# EAGLE design untitled (EAGLE 7.2.0)
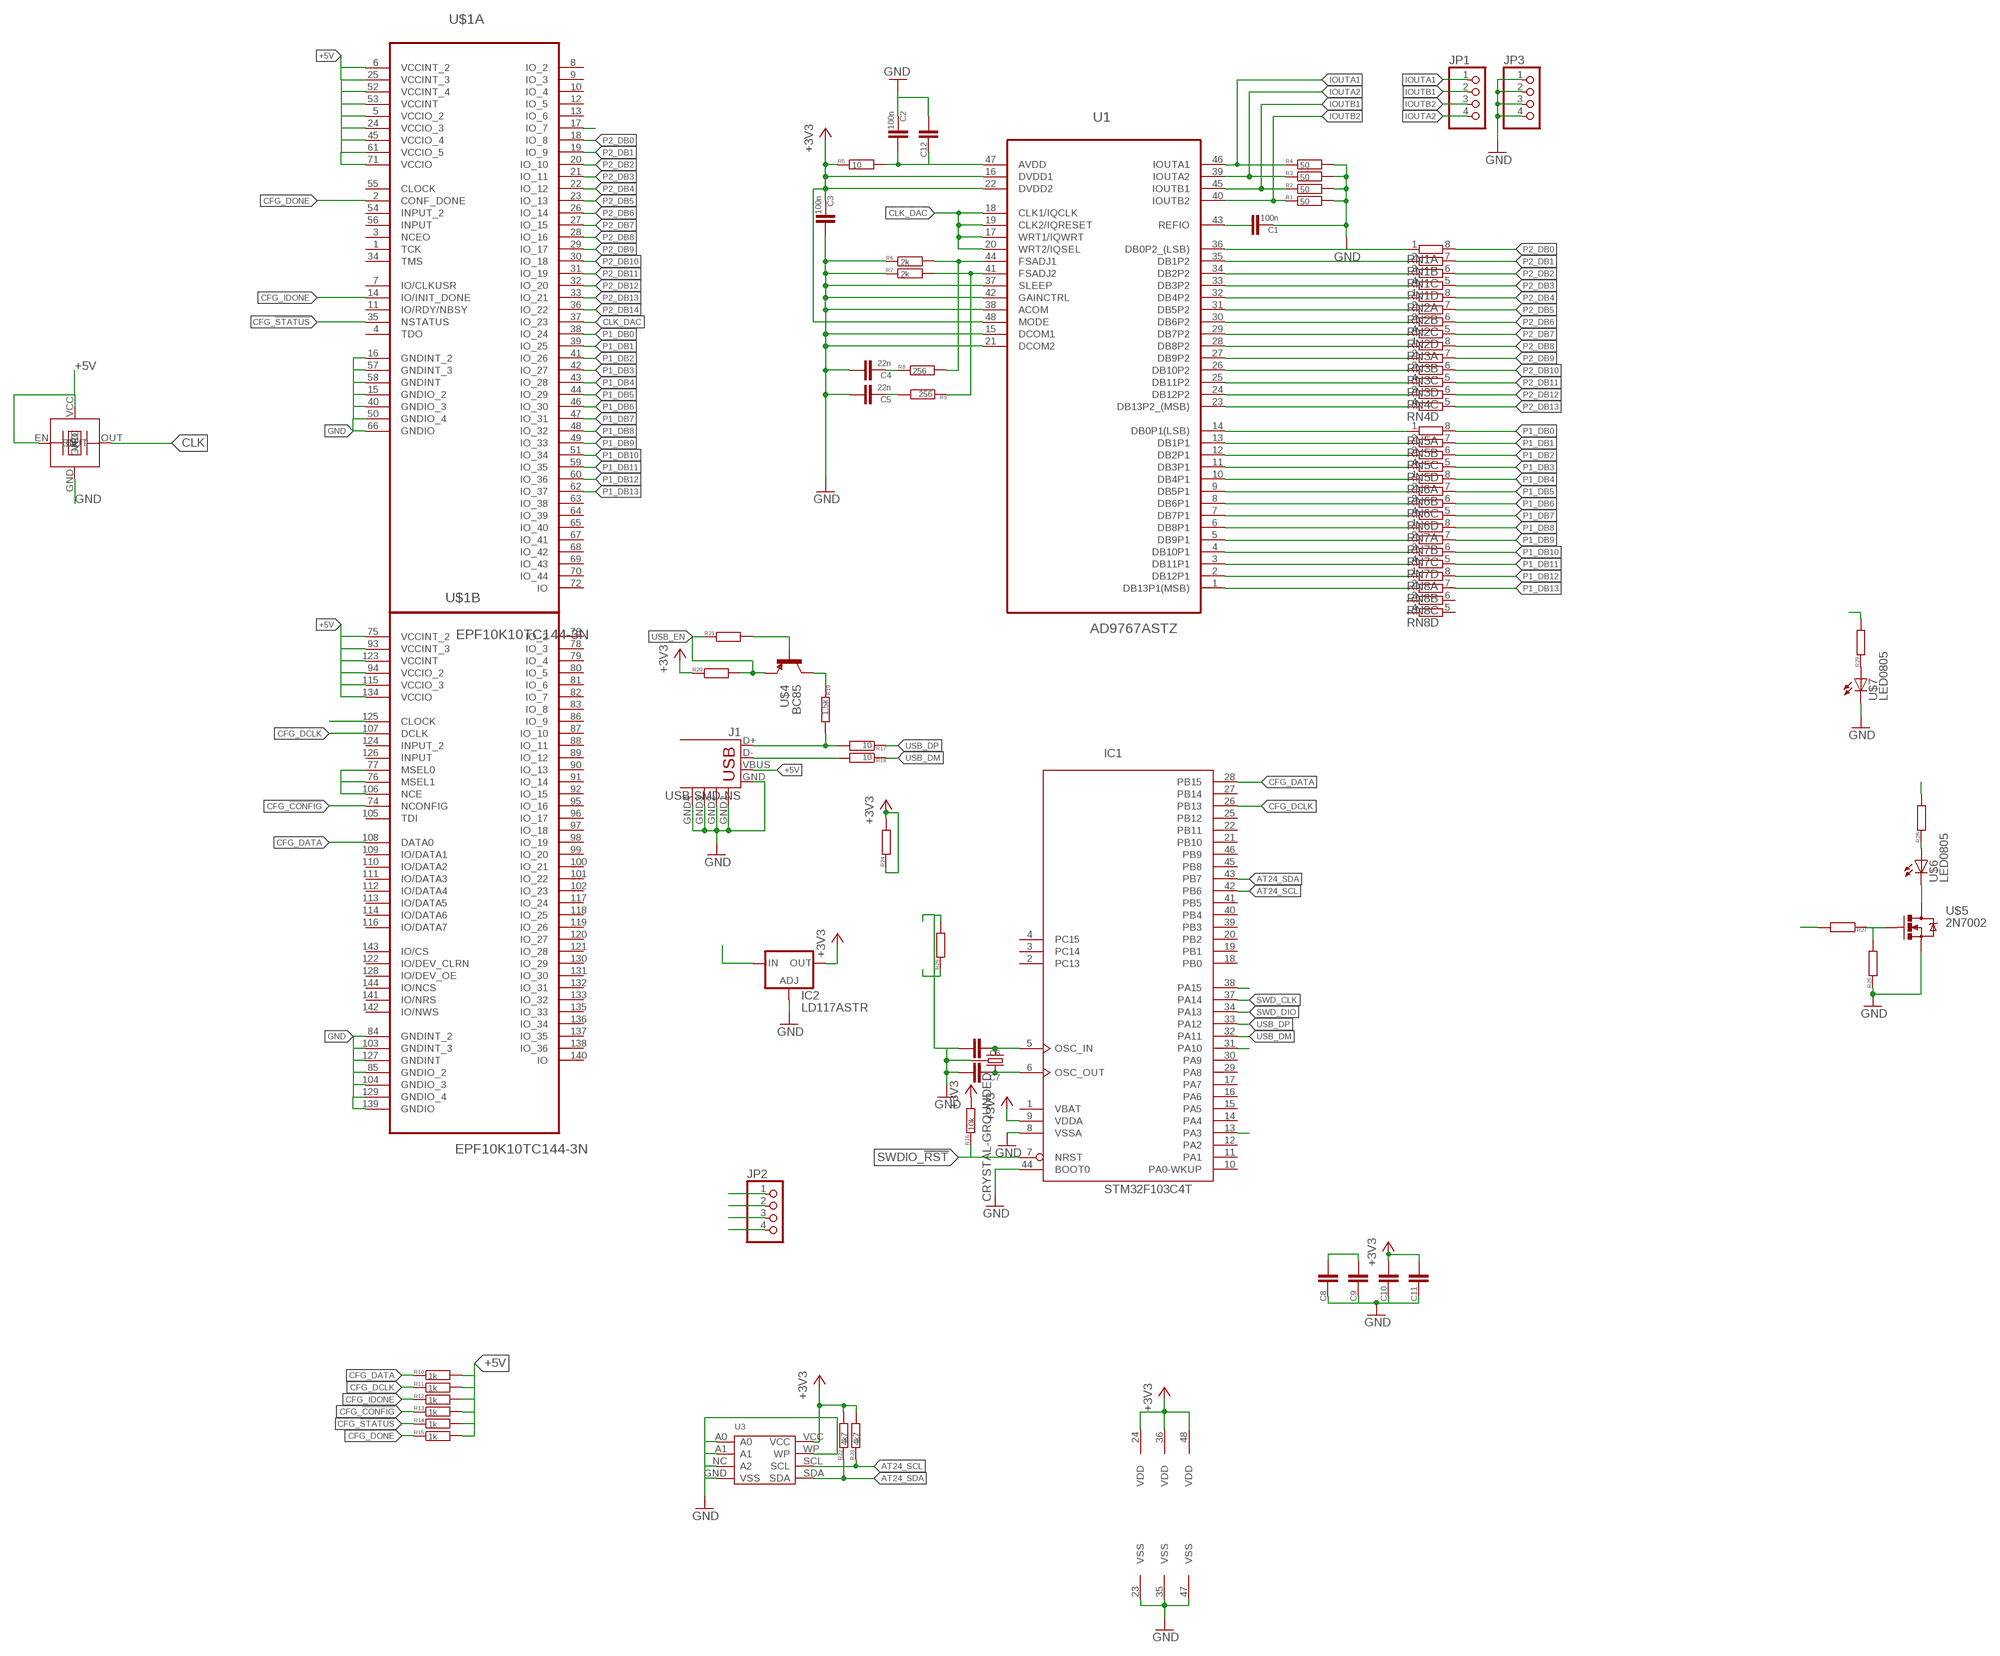
[diagram p0: schematic, sheet 1]

## Parts
C1  100n  CC0805  [C0805]
C2  100n  CC0805  [C0805]
C3  100n  CC0805  [C0805]
C4  22n  CC0805  [C0805]
C5  22n  CC0805  [C0805]
C6  CC0603  [C0603]
C7  CC0603  [C0603]
C8  CC0805  [C0805]
C9  CC0805  [C0805]
C10  CC0805  [C0805]
C11  CC0805  [C0805]
C12  CC0805  [C0805]
IC1  STM32F103C4T  [LQFP48]
IC2  LD117ASTR  [SOT223]
J1  USB-SMD-NS  [USB-MINIB-NOSTOP]
JP1  PINHD-1X04_2.54  [1X04]
JP2  PINHD-1X04_2.54  [1X04]
JP3  PINHD-1X04_2.54  [1X04]
R1  50  R0805  [R0805]
R2  50  R0805  [R0805]
R3  50  R0805  [R0805]
R4  50  R0805  [R0805]
R5  10  R0805  [R0805]
R6  2k  R0805  [R0805]
R7  2k  R0805  [R0805]
R8  256  R0805  [R0805]
R9  256  R0805  [R0805]
R10  1k  R0603  [0603]
R11  1k  R0603  [0603]
R12  1k  R0603  [0603]
R13  1k  R0603  [0603]
R14  1k  R0603  [0603]
R15  1k  R0603  [0603]
R16  10k  R0603  [0603]
R17  10  R0603  [0603]
R18  10  R0603  [0603]
R19  1.5k  R0603  [0603]
R20  R0603  [0603]
R21  R0603  [0603]
R22  4k7  R0603  [0603]
R23  4k7  R0603  [0603]
R24  R1206  [R1206]
R25  R0603  [0603]
R26  R0603  [0603]
R27  R0603  [0603]
R28  R0603  [0603]
R29  R0603  [0603]
RN1  4R-N0402ARV341  [4X0402ARV341]
RN2  4R-N0402ARV341  [4X0402ARV341]
RN3  4R-N0402ARV341  [4X0402ARV341]
RN4  4R-N0402ARV341  [4X0402ARV341]
RN5  4R-N0402ARV341  [4X0402ARV341]
RN6  4R-N0402ARV341  [4X0402ARV341]
RN7  4R-N0402ARV341  [4X0402ARV341]
RN8  4R-N0402ARV341  [4X0402ARV341]
U1  AD9767ASTZ  [QFP50P900X900X160-48N]
U3  EEPROM-CAT24C256WI-GT3(SOIC8)QFN  [QFN]
U$1  EPF10K10TC144-3N  [QFP50P2200X2200X160-144N]
U$2  TXC-BA  [7X5]
U$3  CRYSTAL-GROUNDED  [CRYSTAL-SMD-5X3]
U$4  BC85  [SOT23]
U$5  2N7002  [SOT23]
U$6  LED0805  [0805-LED]
U$7  LED0805  [0805-LED]

## Nets
+3V3: C3.2 C10.1 C11.1 IC1.9(VDDA) IC1.24(VDD) IC1.36(VDD) IC1.48(VDD) IC2.4(OUT) R5.1 R16.2 R20.1 R22.2 R23.2 R24.1 R24.2 U1.16(DVDD1) U1.22(DVDD2) U1.48(MODE) U3.VCC
+5V: C8.1 C9.1 IC2.3(IN) J1.VBUS R10.2 R11.2 R12.2 R13.2 R14.2 R15.2 R28.2 U$1.5(A:VCCIO_2) U$1.6(A:VCCINT_2) U$1.24(A:VCCIO_3) U$1.25(A:VCCINT_3) U$1.45(A:VCCIO_4) U$1.52(A:VCCINT_4) U$1.53(A:VCCINT) U$1.61(A:VCCIO_5) U$1.71(A:VCCIO) U$1.75(B:VCCINT_2) U$1.93(B:VCCINT_3) U$1.94(B:VCCIO_2) U$1.115(B:VCCIO_3) U$1.123(B:VCCINT) U$1.134(B:VCCIO) U$2.EN U$2.VCC
AT24_SCL: IC1.42(PB6) R23.1 U3.SCL
AT24_SDA: IC1.43(PB7) R22.1 U3.SDA
CFG_!CONFIG: IC1.31(PA10) R13.1 U$1.74(B:NCONFIG)
CFG_!STATUS: R14.1 U$1.35(A:NSTATUS)
CFG_DATA: IC1.28(PB15) R10.1 U$1.108(B:DATA0)
CFG_DCLK: IC1.26(PB13) R11.1 U$1.107(B:DCLK)
CFG_DONE: R15.1 R27.2 U$1.2(A:CONF_DONE)
CFG_IDONE: R12.1 U$1.14(A:IO/INIT_DONE)
CLK: U$1.125(B:CLOCK) U$2.OUT
CLK_DAC: U1.17(WRT1/IQWRT) U1.18(CLK1/IQCLK) U1.19(CLK2/IQRESET) U1.20(WRT2/IQSEL) U$1.37(A:IO_23)
FSADJ1: R6.2 R8.2 U1.44(FSADJ1)
FSADJ2: R7.2 R9.1 U1.41(FSADJ2)
GND: C1.2 C2.2 C3.1 C4.1 C5.1 C6.1 C7.1 C8.2 C9.2 C10.2 C11.2 C12.1 IC1.8(VSSA) IC1.23(VSS) IC1.35(VSS) IC1.38(PA15) IC1.44(BOOT0) IC1.47(VSS) IC2.1(ADJ) J1.GND J1.GND1(GND) J1.GND2(GND) J1.GND3(GND) J1.GND4(GND) JP2.1 JP3.1 JP3.2 JP3.3 JP3.4 R1.2 R2.2 R3.2 R4.2 R6.1 R7.1 R25.1 R26.1 R26.2 U1.15(DCOM1) U1.21(DCOM2) U1.37(SLEEP) U1.38(ACOM) U1.42(GAINCTRL) U3.A0 U3.A1 U3.GND(VSS) U3.NC(A2) U3.WP U$1.15(A:GNDIO_2) U$1.16(A:GNDINT_2) U$1.40(A:GNDIO_3) U$1.50(A:GNDIO_4) U$1.57(A:GNDINT_3) U$1.58(A:GNDINT) U$1.66(A:GNDIO) U$1.76(B:MSEL1) U$1.77(B:MSEL0) U$1.84(B:GNDINT_2) U$1.85(B:GNDIO_2) U$1.103(B:GNDINT_3) U$1.104(B:GNDIO_3) U$1.106(B:NCE) U$1.127(B:GNDINT) U$1.129(B:GNDIO_4) U$1.139(B:GNDIO) U$2.GND U$3.2 U$3.4 U$5.2(S) U$7.C
IO7: R29.2 U$1.17(A:IO_7)
IOUTA1: JP1.1 R4.1 U1.46(IOUTA1)
IOUTA2: JP1.4 R3.1 U1.39(IOUTA2)
IOUTB1: JP1.2 R2.1 U1.45(IOUTB1)
IOUTB2: JP1.3 R1.1 U1.40(IOUTB2)
N$1: C4.2 R8.1
N$2: C5.2 R9.2
N$3: C2.1 C12.2 R5.2 U1.47(AVDD)
N$5: C1.1 U1.43(REFIO)
N$6: J1.D- R18.2
N$7: R25.2 R27.1 U$5.1(G)
N$8: J1.D+ R17.2 R19.2
N$9: R19.1 U$4.3(C)
N$10: C6.2 IC1.5(OSC_IN) U$3.3
N$11: C7.2 IC1.6(OSC_OUT) U$3.1
N$12: R21.2 U$4.1(B)
N$13: R29.1 U$7.A
N$14: U$5.3(D) U$6.C
N$15: R28.1 U$6.A
P1_DB0: RN5.8 U$1.38(A:IO_24)
P1_DB0=: RN5.1 U1.14(DB0P1(LSB))
P1_DB1: RN5.7 U$1.39(A:IO_25)
P1_DB1=: RN5.2 U1.13(DB1P1)
P1_DB2: RN5.6 U$1.41(A:IO_26)
P1_DB2=: RN5.3 U1.12(DB2P1)
P1_DB3: RN5.5 U$1.42(A:IO_27)
P1_DB3=: RN5.4 U1.11(DB3P1)
P1_DB4: RN6.8 U$1.43(A:IO_28)
P1_DB4=: RN6.1 U1.10(DB4P1)
P1_DB5: RN6.7 U$1.44(A:IO_29)
P1_DB5=: RN6.2 U1.9(DB5P1)
P1_DB6: RN6.6 U$1.46(A:IO_30)
P1_DB6=: RN6.3 U1.8(DB6P1)
P1_DB7: RN6.5 U$1.47(A:IO_31)
P1_DB7=: RN6.4 U1.7(DB7P1)
P1_DB8: RN7.8 U$1.48(A:IO_32)
P1_DB8=: RN7.1 U1.6(DB8P1)
P1_DB9: RN7.7 U$1.49(A:IO_33)
P1_DB9=: RN7.2 U1.5(DB9P1)
P1_DB10: RN7.6 U$1.51(A:IO_34)
P1_DB10=: RN7.3 U1.4(DB10P1)
P1_DB11: RN7.5 U$1.59(A:IO_35)
P1_DB11=: RN7.4 U1.3(DB11P1)
P1_DB12: RN8.8 U$1.60(A:IO_36)
P1_DB12=: RN8.1 U1.2(DB12P1)
P1_DB13: RN8.7 U$1.62(A:IO_37)
P1_DB13=: RN8.2 U1.1(DB13P1(MSB))
P2_DB0: RN1.8 U$1.18(A:IO_8)
P2_DB0=: RN1.1 U1.36(DB0P2_(LSB))
P2_DB1: RN1.7 U$1.19(A:IO_9)
P2_DB1=: RN1.2 U1.35(DB1P2)
P2_DB2: RN1.6 U$1.20(A:IO_10)
P2_DB2=: RN1.3 U1.34(DB2P2)
P2_DB3: RN1.5 U$1.21(A:IO_11)
P2_DB3=: RN1.4 U1.33(DB3P2)
P2_DB4: RN2.8 U$1.22(A:IO_12)
P2_DB4=: RN2.1 U1.32(DB4P2)
P2_DB5: RN2.7 U$1.23(A:IO_13)
P2_DB5=: RN2.2 U1.31(DB5P2)
P2_DB6: RN2.6 U$1.26(A:IO_14)
P2_DB6=: RN2.3 U1.30(DB6P2)
P2_DB7: RN2.5 U$1.27(A:IO_15)
P2_DB7=: RN2.4 U1.29(DB7P2)
P2_DB8: RN3.8 U$1.28(A:IO_16)
P2_DB8=: RN3.1 U1.28(DB8P2)
P2_DB9: RN3.7 U$1.29(A:IO_17)
P2_DB9=: RN3.2 U1.27(DB9P2)
P2_DB10: RN3.6 U$1.30(A:IO_18)
P2_DB10=: RN3.3 U1.26(DB10P2)
P2_DB11: RN3.5 U$1.31(A:IO_19)
P2_DB11=: RN3.4 U1.25(DB11P2)
P2_DB12: RN4.6 U$1.32(A:IO_20)
P2_DB12=: RN4.3 U1.24(DB12P2)
P2_DB13: RN4.5 U$1.33(A:IO_21)
P2_DB13=: RN4.4 U1.23(DB13P2_(MSB))
P2_DB14: U$1.36(A:IO_22)
SWD_CLK: IC1.37(PA14) JP2.3
SWD_DIO: IC1.34(PA13) JP2.2
SWDIO_!RST: IC1.7(NRST) JP2.4 R16.1
USB_DM: IC1.32(PA11) R18.1
USB_DP: IC1.33(PA12) R17.1
USB_EN: IC1.13(PA3) R20.2 R21.1 U$4.2(E)
Unconnected: IC1.2(PC13) IC1.3(PC14) IC1.4(PC15) IC1.10(PA0-WKUP) IC1.11(PA1) IC1.12(PA2) IC1.14(PA4) IC1.15(PA5) IC1.16(PA6) IC1.17(PA7) IC1.18(PB0) IC1.19(PB1) IC1.20(PB2) IC1.21(PB10) IC1.22(PB11) IC1.25(PB12) IC1.27(PB14) IC1.29(PA8) IC1.30(PA9) IC1.39(PB3) IC1.40(PB4) IC1.41(PB5) IC1.45(PB8) IC1.46(PB9) RN4.1 RN4.2 RN4.7 RN4.8 RN8.3 RN8.4 RN8.5 RN8.6 U$1.1(A:TCK) U$1.3(A:NCEO) U$1.4(A:TDO) U$1.7(A:IO/CLKUSR) U$1.8(A:IO_2) U$1.9(A:IO_3) U$1.10(A:IO_4) U$1.11(A:IO/RDY/NBSY) U$1.12(A:IO_5) U$1.13(A:IO_6) U$1.34(A:TMS) U$1.54(A:INPUT_2) U$1.55(A:CLOCK) U$1.56(A:INPUT) U$1.63(A:IO_38) U$1.64(A:IO_39) U$1.65(A:IO_40) U$1.67(A:IO_41) U$1.68(A:IO_42) U$1.69(A:IO_43) U$1.70(A:IO_44) U$1.72(A:IO) U$1.73(B:IO_2) U$1.78(B:IO_3) U$1.79(B:IO_4) U$1.80(B:IO_5) U$1.81(B:IO_6) U$1.82(B:IO_7) U$1.83(B:IO_8) U$1.86(B:IO_9) U$1.87(B:IO_10) U$1.88(B:IO_11) U$1.89(B:IO_12) U$1.90(B:IO_13) U$1.91(B:IO_14) U$1.92(B:IO_15) U$1.95(B:IO_16) U$1.96(B:IO_17) U$1.97(B:IO_18) U$1.98(B:IO_19) U$1.99(B:IO_20) U$1.100(B:IO_21) U$1.101(B:IO_22) U$1.102(B:IO_23) U$1.105(B:TDI) U$1.109(B:IO/DATA1) U$1.110(B:IO/DATA2) U$1.111(B:IO/DATA3) U$1.112(B:IO/DATA4) U$1.113(B:IO/DATA5) U$1.114(B:IO/DATA6) U$1.116(B:IO/DATA7) U$1.117(B:IO_24) U$1.118(B:IO_25) U$1.119(B:IO_26) U$1.120(B:IO_27) U$1.121(B:IO_28) U$1.122(B:IO/DEV_CLRN) U$1.124(B:INPUT_2) U$1.126(B:INPUT) U$1.128(B:IO/DEV_OE) U$1.130(B:IO_29) U$1.131(B:IO_30) U$1.132(B:IO_31) U$1.133(B:IO_32) U$1.135(B:IO_33) U$1.136(B:IO_34) U$1.137(B:IO_35) U$1.138(B:IO_36) U$1.140(B:IO) U$1.141(B:IO/NRS) U$1.142(B:IO/NWS) U$1.143(B:IO/CS) U$1.144(B:IO/NCS)

## Power pins joined to a net without a drawn wire
VBAT: IC1.1(VBAT)

## Library data of the parts
C1-C12 = smalsmd:C: Capacitor
IC1 = stm32:STM32F103C*T: ARM 32-bit Cortex™-M3 CPU 72 MHz maximum frequency 16 to 128 Kbytes of Flash memory 6 to 20 kbytes of SRAM 37 GPIOs 2.0 to 3.6 V application supply
IC2 = v-reg:LD117A?*: Low drop fixed and adjustable positive voltage regulators 1 A Source: http://www.st.com/stonline/products/literature/ds/7194/ld1117axx.pdf
J1 = SparkFun-Connectors:USB: USB Connectors USB-B-PTH is fully proven SKU : PRT-00139/CONN-08278 USB-miniB is fully proven SKU : PRT-00587 USB-A-PCB is untested. USB-A-H is throughly reviewed, but untested. Spark Fun Electronics SKU : PRT-00437 USB-B-SMT is throughly reviewed, but untested. Needs silkscreen touching up. USB-A-S has not been used/tested USB-MB-H has not been used/tested USB-MICROB has been used. CONN-09505
JP1-JP3 = pinhead-2:PINHD-1X04: PIN HEADER
R1-R29 = smalsmd:R
RN1-RN8 = resistor-dil:4R-N: Array Chip Resistor Source: RS Component / Phycomp; OC_FARNELL: unknown; OC_NEWARK: unknown
U1 = Analog Devices_By_element14_Batch_1:AD9767ASTZ: Digital-to-Analog Converter; MPN: AD9767ASTZ; OC_FARNELL: -; OC_NEWARK: 59K7411; PACKAGE: QFP-48; SUPPLIER: ANALOG DEVICES
U3 = at24c512:EEPROM-CAT24C256WI-GT3(SOIC8): 310090035
U$1 = Altera_By_element14_Batch_1:EPF10K10TC144-3N: Embedded Programmable Logic Device; MPN: EPF10K10TC144-3N; OC_FARNELL: 1549377; OC_NEWARK: 51R8772; PACKAGE: QFP-144; SUPPLIER: Altera
U$2 = txc:TXC-BA**
U$3 = SparkFun-FreqCtrl:CRYSTAL-GROUNDED
U$4 = smalsmd:BC85*
U$5 = smalsmd:2N7002
U$6 U$7 = smalsmd:LED

## Board
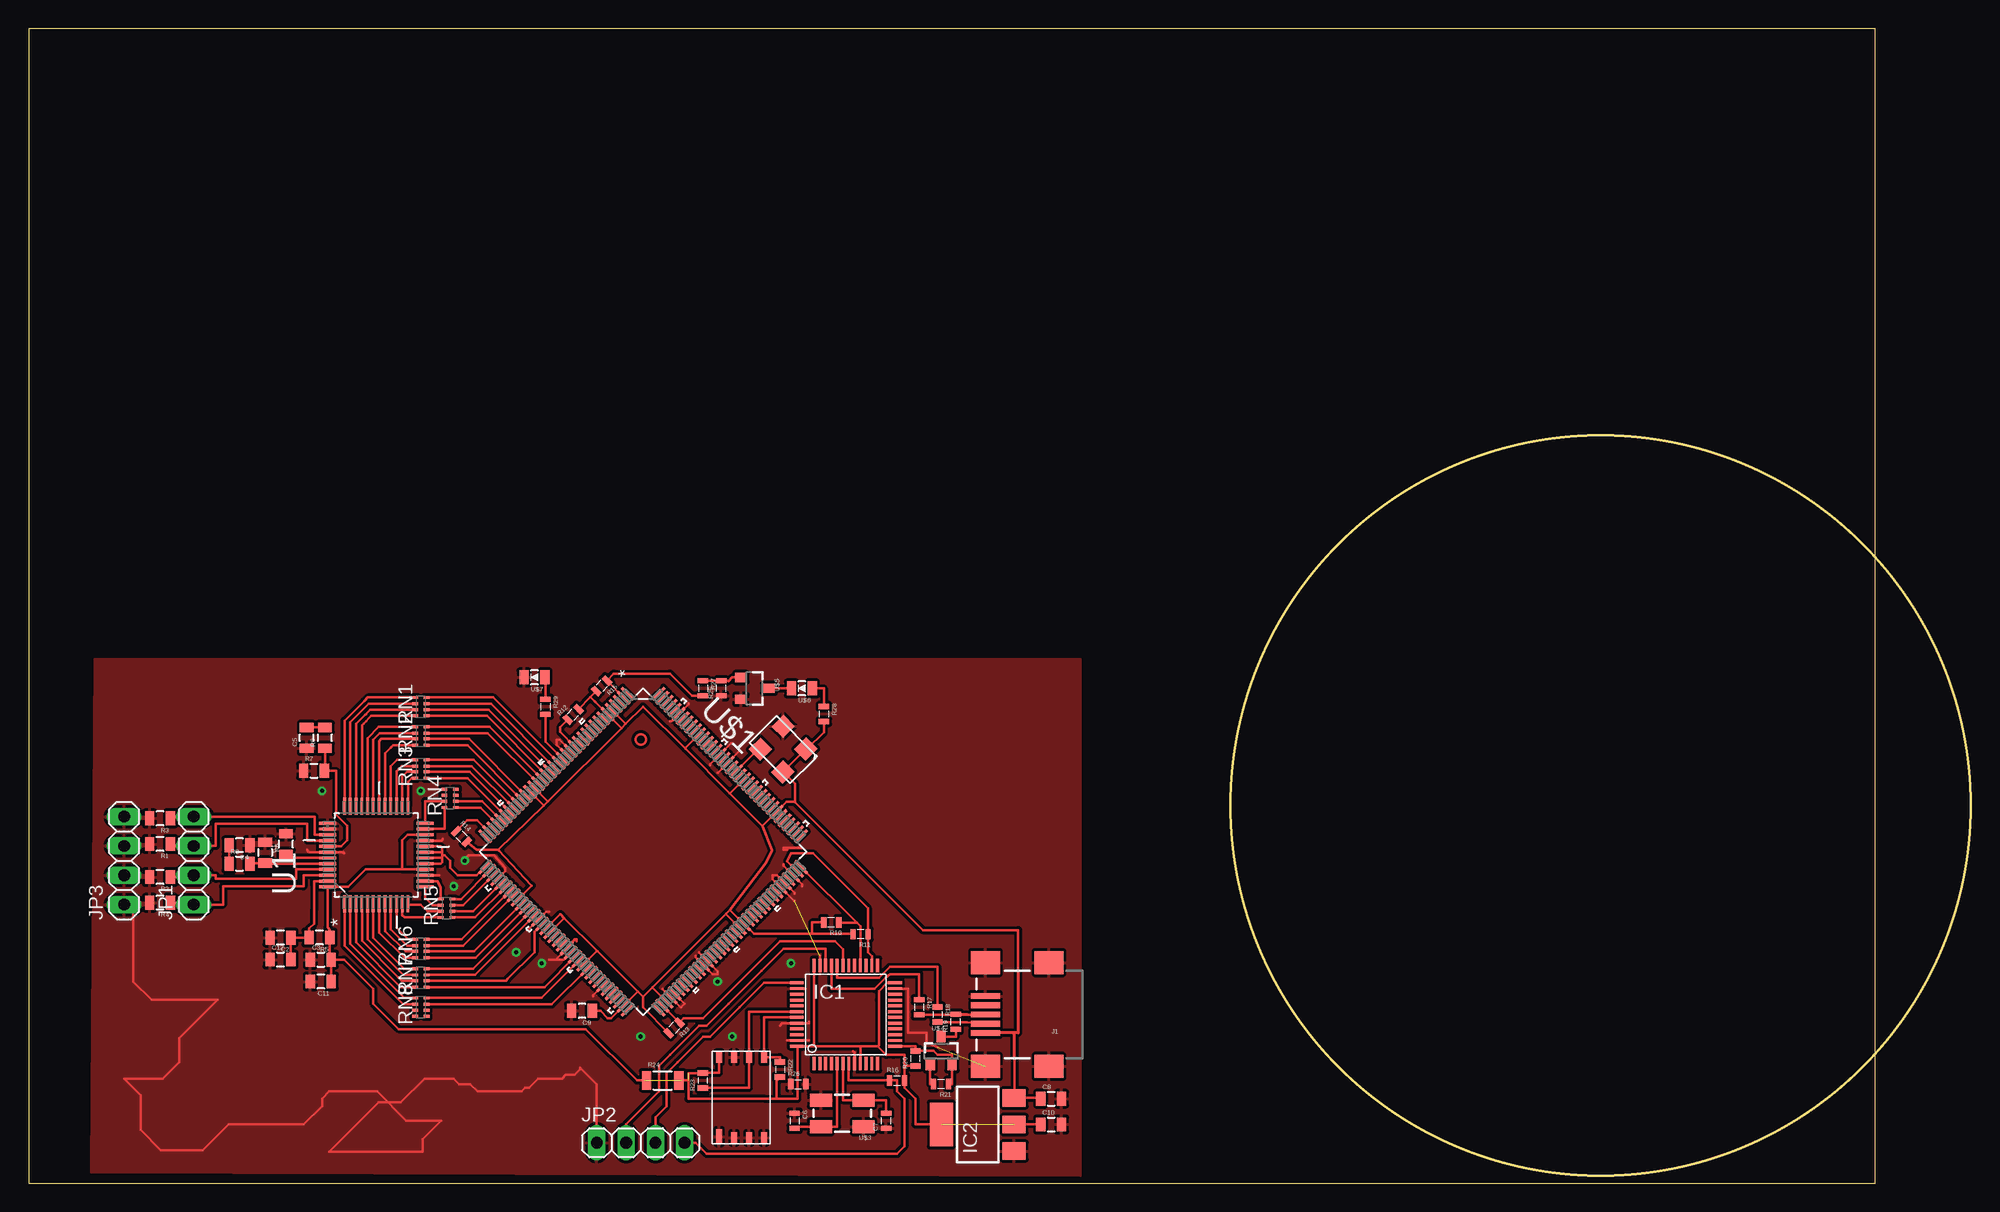
[diagram p1: board, top side]
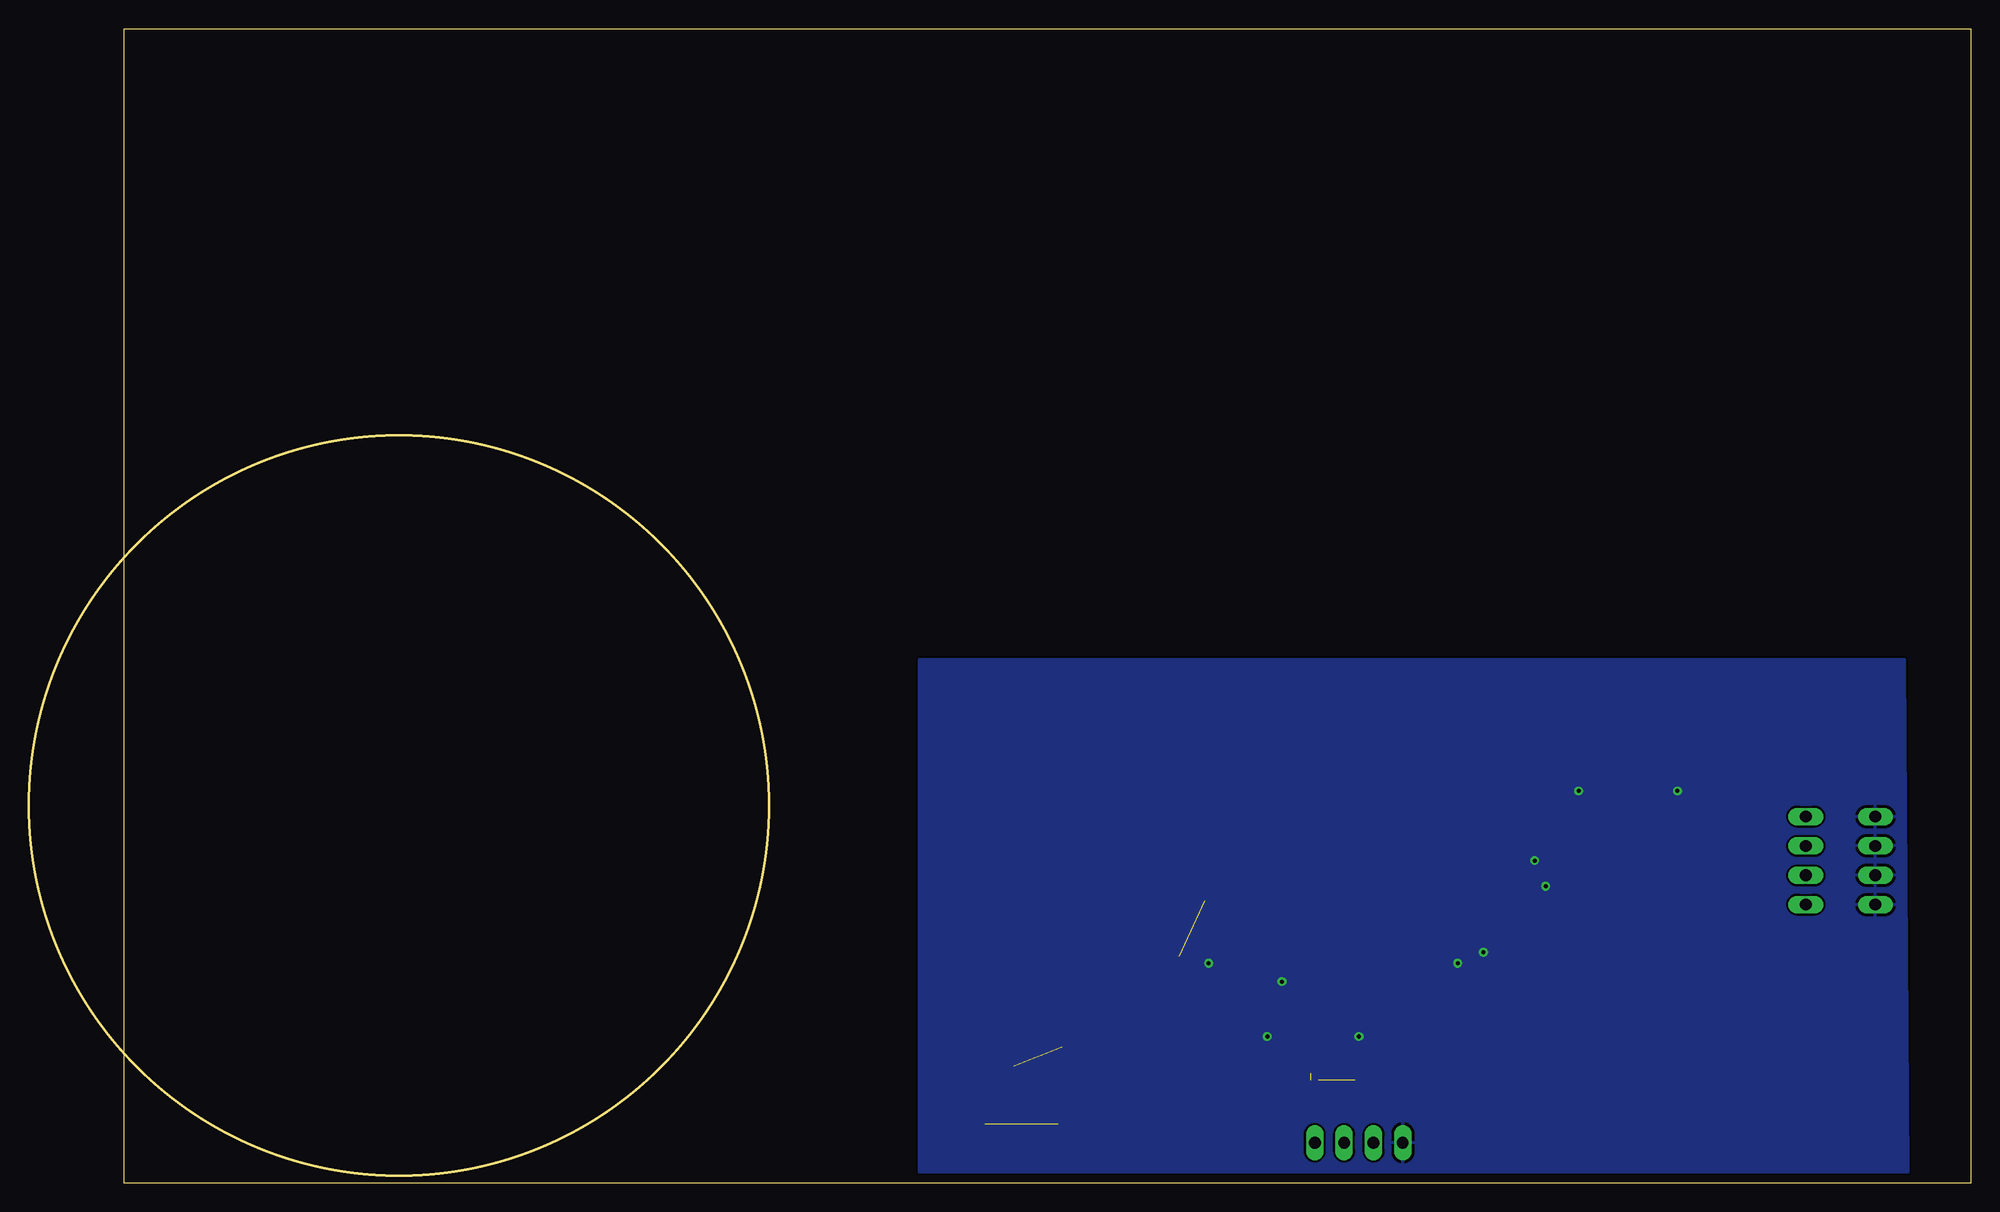
[diagram p2: board, bottom side, seen from below]

Size 168.28 x 100 mm. Coordinates in mm from the lower left corner, seen from the top.
Outline: 0,0 160,0 160,100 0,100 0,0
Outline: circle at 136.21,32.7 radius 32.07
Copper layers (1*16): Top 0.035mm / dielectric 1.5mm / Bottom 0.035mm
Design rules "default *": minimum track width 0.2mm, minimum drill 24mil, track to track 0.2mm, track to pad 0.2mm, pad to pad 0.15mm, via to via 0.15mm, smd to smd 0.1mm, copper to edge 0.15mm, drill to drill 0.15mm, minimum pad ring 10mil, minimum via ring 8mil, stop-mask expansion 4mil, vias tented up to drill 0mil, thermal gap 10mil

### Footprints (pad centres in the part's own frame; a part is rotated, then mirrored left to right if it is on the bottom)
C0805 = smd 0.8 x 1.2: 1 -0.9,0; 2 0.9,0
C0603 = smd 0.45 x 0.9: 1 -0.65,0; 2 0.65,0
LQFP48 = smd 0.25 x 1.2: 1 -2.75,-4.25; 2 -2.25,-4.25; 3 -1.75,-4.25; 4 -1.25,-4.25; 5 -0.75,-4.25; 6 -0.25,-4.25; 7 0.25,-4.25; 8 0.75,-4.25; 9 1.25,-4.25; 10 1.75,-4.25; 11 2.25,-4.25; 12 2.75,-4.25; 25 2.75,4.25; 26 2.25,4.25; 27 1.75,4.25; 28 1.25,4.25; 29 0.75,4.25; 30 0.25,4.25; 31 -0.25,4.25; 32 -0.75,4.25; 33 -1.25,4.25; 34 -1.75,4.25; 35 -2.25,4.25; 36 -2.75,4.25 | smd 1.2 x 0.25: 13 4.25,-2.75; 14 4.25,-2.25; 15 4.25,-1.75; 16 4.25,-1.25; 17 4.25,-0.75; 18 4.25,-0.25; 19 4.25,0.25; 20 4.25,0.75; 21 4.25,1.25; 22 4.25,1.75; 23 4.25,2.25; 24 4.25,2.75; 37 -4.25,2.75; 38 -4.25,2.25; 39 -4.25,1.75; 40 -4.25,1.25; 41 -4.25,0.75; 42 -4.25,0.25; 43 -4.25,-0.25; 44 -4.25,-0.75; 45 -4.25,-1.25; 46 -4.25,-1.75; 47 -4.25,-2.25; 48 -4.25,-2.75
SOT223 = smd 1.5 x 2: 1 -2.3,-3.15; 2 0,-3.15; 3 2.3,-3.15 | smd 3.8 x 2: 4 0,3.15
USB-MINIB-NOSTOP = smd 2.5 x 0.5: D+ 2.5,0; D- 2.5,0.8; GND 2.5,-1.6; ID 2.5,-0.8; VBUS 2.5,1.6 | smd 2.5 x 2: GND1 -3,4.5; GND2 2.5,4.5; GND3 2.5,-4.5; GND4 -3,-4.5
1X04 = drill 1.016 long: 1 -3.81,0; 2 -1.27,0; 3 1.27,0; 4 3.81,0
R0805 = smd 0.8 x 1.2: 1 -0.9,0; 2 0.9,0
0603 = smd 0.45 x 0.9: 1 -0.65,0; 2 0.65,0
R1206 = smd 0.8 x 1.6: 1 -1.4,0; 2 1.4,0
4X0402ARV341 = smd 0.25 x 0.5: 1 -0.8,-0.5; 2 -0.25,-0.5; 3 0.25,-0.5; 4 0.8,-0.5; 5 0.8,0.5; 6 0.25,0.5; 7 -0.25,0.5; 8 -0.8,0.5
QFP50P900X900X160-48N = smd 1.473 x 0.25: 1 -4.216,2.743; 2 -4.216,2.261; 3 -4.216,1.753; 4 -4.216,1.245; 5 -4.216,0.762; 6 -4.216,0.254; 7 -4.216,-0.254; 8 -4.216,-0.762; 9 -4.216,-1.245; 10 -4.216,-1.753; 11 -4.216,-2.261; 12 -4.216,-2.743; 25 4.216,-2.743; 26 4.216,-2.261; 27 4.216,-1.753; 28 4.216,-1.245; 29 4.216,-0.762; 30 4.216,-0.254; 31 4.216,0.254; 32 4.216,0.762; 33 4.216,1.245; 34 4.216,1.753; 35 4.216,2.261; 36 4.216,2.743 | smd 0.25 x 1.473: 13 -2.743,-4.216; 14 -2.261,-4.216; 15 -1.753,-4.216; 16 -1.245,-4.216; 17 -0.762,-4.216; 18 -0.254,-4.216; 19 0.254,-4.216; 20 0.762,-4.216; 21 1.245,-4.216; 22 1.753,-4.216; 23 2.261,-4.216; 24 2.743,-4.216; 37 2.743,4.216; 38 2.261,4.216; 39 1.753,4.216; 40 1.245,4.216; 41 0.762,4.216; 42 0.254,4.216; 43 -0.254,4.216; 44 -0.762,4.216; 45 -1.245,4.216; 46 -1.753,4.216; 47 -2.261,4.216; 48 -2.743,4.216
QFN = smd 1.3 x 0.5: A0 -3.6,2.1 | smd 1 x 0.5: A1 -3.7,0.8; GND -3.7,-1.8; NC -3.7,-0.5; SCL 3.3,-0.5; SDA 3.3,-1.8; VCC 3.3,2.1; WP 3.3,0.8
QFP50P2200X2200X160-144N = smd 1.473 x 0.25: 1 -10.617,8.738; 2 -10.617,8.255; 3 -10.617,7.747; 4 -10.617,7.239; 5 -10.617,6.756; 6 -10.617,6.248; 7 -10.617,5.74; 8 -10.617,5.258; 9 -10.617,4.75; 10 -10.617,4.242; 11 -10.617,3.759; 12 -10.617,3.251; 13 -10.617,2.743; 14 -10.617,2.261; 15 -10.617,1.753; 16 -10.617,1.245; 17 -10.617,0.762; 18 -10.617,0.254; 19 -10.617,-0.254; 20 -10.617,-0.762; 21 -10.617,-1.245; 22 -10.617,-1.753; 23 -10.617,-2.261; 24 -10.617,-2.743; 25 -10.617,-3.251; 26 -10.617,-3.759; 27 -10.617,-4.242; 28 -10.617,-4.75; 29 -10.617,-5.258; 30 -10.617,-5.74; 31 -10.617,-6.248; 32 -10.617,-6.756; 33 -10.617,-7.239; 34 -10.617,-7.747; 35 -10.617,-8.255; 36 -10.617,-8.738; 73 10.617,-8.738; 74 10.617,-8.255; 75 10.617,-7.747; 76 10.617,-7.239; 77 10.617,-6.756; 78 10.617,-6.248; 79 10.617,-5.74; 80 10.617,-5.258; 81 10.617,-4.75; 82 10.617,-4.242; 83 10.617,-3.759; 84 10.617,-3.251; 85 10.617,-2.743; 86 10.617,-2.261; 87 10.617,-1.753; 88 10.617,-1.245; 89 10.617,-0.762; 90 10.617,-0.254; 91 10.617,0.254; 92 10.617,0.762; 93 10.617,1.245; 94 10.617,1.753; 95 10.617,2.261; 96 10.617,2.743; 97 10.617,3.251; 98 10.617,3.759; 99 10.617,4.242; 100 10.617,4.75; 101 10.617,5.258; 102 10.617,5.74; 103 10.617,6.248; 104 10.617,6.756; 105 10.617,7.239; 106 10.617,7.747; 107 10.617,8.255; 108 10.617,8.738 | smd 0.25 x 1.473: 37 -8.738,-10.617; 38 -8.255,-10.617; 39 -7.747,-10.617; 40 -7.239,-10.617; 41 -6.756,-10.617; 42 -6.248,-10.617; 43 -5.74,-10.617; 44 -5.258,-10.617; 45 -4.75,-10.617; 46 -4.242,-10.617; 47 -3.759,-10.617; 48 -3.251,-10.617; 49 -2.743,-10.617; 50 -2.261,-10.617; 51 -1.753,-10.617; 52 -1.245,-10.617; 53 -0.762,-10.617; 54 -0.254,-10.617; 55 0.254,-10.617; 56 0.762,-10.617; 57 1.245,-10.617; 58 1.753,-10.617; 59 2.261,-10.617; 60 2.743,-10.617; 61 3.251,-10.617; 62 3.759,-10.617; 63 4.242,-10.617; 64 4.75,-10.617; 65 5.258,-10.617; 66 5.74,-10.617; 67 6.248,-10.617; 68 6.756,-10.617; 69 7.239,-10.617; 70 7.747,-10.617; 71 8.255,-10.617; 72 8.738,-10.617; 109 8.738,10.617; 110 8.255,10.617; 111 7.747,10.617; 112 7.239,10.617; 113 6.756,10.617; 114 6.248,10.617; 115 5.74,10.617; 116 5.258,10.617; 117 4.75,10.617; 118 4.242,10.617; 119 3.759,10.617; 120 3.251,10.617; 121 2.743,10.617; 122 2.261,10.617; 123 1.753,10.617; 124 1.245,10.617; 125 0.762,10.617; 126 0.254,10.617; 127 -0.254,10.617; 128 -0.762,10.617; 129 -1.245,10.617; 130 -1.753,10.617; 131 -2.261,10.617; 132 -2.743,10.617; 133 -3.251,10.617; 134 -3.759,10.617; 135 -4.242,10.617; 136 -4.75,10.617; 137 -5.258,10.617; 138 -5.74,10.617; 139 -6.248,10.617; 140 -6.756,10.617; 141 -7.239,10.617; 142 -7.747,10.617; 143 -8.255,10.617; 144 -8.738,10.617
7X5 = smd 1.4 x 1.45: EN -1.448,-1.465; GND 1.333,-1.465; OUT 1.333,1.345; VCC -1.448,1.345
CRYSTAL-SMD-5X3 = smd 1.9 x 1.1: 1 -1.85,-1.15; 2 1.85,-1.15; 3 1.85,1.15; 4 -1.85,1.15
SOT23 = smd 0.8 x 1: 1 -0.95,-1.159; 2 0.95,-1.159; 3 0,1.259
0805-LED = smd 0.8 x 1.2: A -0.9,0; C 0.9,0

### Placement (x,y rotation side)
C1  22.28,29.36 90 top
C2  21.8,21.27 180 top
C3  25.3,19.36 0 top
C4  18.26,29.26 180 top
C5  24.08,38.58 90 top
C6  66.36,5.4 270 top
C7  74.3,5.4 90 top
C8  88.58,7.3 0 top
C9  47.94,14.92 180 top
C10  88.58,5.08 0 top
C11  25.3,17.46 180 top
C12  21.8,19.37 0 top
IC1  70.8,14.61 0 top
IC2  82.23,5.08 90 top
J1  85.41,14.61 180 top
JP1  14.29,27.94 90 top
JP2  53.02,3.49 0 top
JP3  8.26,27.94 90 top
R1  11.38,29.37 180 top
R2  11.38,26.52 180 top
R3  11.38,31.6 180 top
R4  11.38,24.29 180 top
R5  25.19,21.28 180 top
R6  20.48,28.63 270 top
R7  24.71,35.72 0 top
R8  18.26,27.68 0 top
R9  25.66,38.58 90 top
R10  [0603]  69.53,22.58 180 top
R11  [0603]  72.07,21.55 180 top
R12  [0603]  47.16,40.61 45 top
R13  [0603]  55.92,13.45 225 top
R14  [0603]  37.49,30.02 315 top
R15  [0603]  49.63,43.08 225 top
R16  [0603]  75.25,8.89 0 top
R17  [0603]  77.15,15.24 270 top
R18  [0603]  78.74,14.61 270 top
R19  [0603]  80.33,13.97 90 top
R20  76.83,10.79 90 top
R21  79.06,8.57 180 top
R22  [0603]  65.09,9.84 270 top
R23  [0603]  58.42,8.89 90 top
R24  54.93,8.89 0 top
R25  60.01,42.86 90 top
R26  66.67,8.57 0 top
R27  58.42,42.86 270 top
R28  68.9,40.64 270 top
R29  44.77,41.27 270 top
RN1  33.97,41.27 270 top
RN2  33.97,38.73 270 top
RN3  33.97,35.88 270 top
RN4  36.51,33.34 270 top
RN5  36.2,23.81 270 top
RN6  33.97,20.32 270 top
RN7  33.97,17.78 270 top
RN8  33.97,15.24 270 top
U1  30.11,28.42 90 top
U3  61.91,7.62 90 top
U$1  53.22,28.71 315 top
U$2  TXC-BA*  [7X5]  65.27,37.6 135 top
U$3  70.48,6.03 180 top
U$4  79.06,11.43 0 top
U$5  62.87,42.86 270 top
U$6  66.99,42.86 180 top
U$7  43.81,43.81 180 top

### Tracks (layer width: path | path; a pad name or v marks a point on that pad's centre or on a via)
+3V3  (5 unrouted)
  Top 0.152: 74.38,17.36 73.66,16.64 73.66,16.51
  Top 0.2: IC1.24 74.38,17.36 | 73.66,16.51 73.66,15.88 | 75.9,10.15 75.9,11.11 74.93,11.11 | 75.9,10.15 R16.2 75.9,8.24 76.83,7.3 76.83,5.08 IC2.4 | R20.1 75.9,10.14 75.9,10.15 | 57.15,8.89 56.52,8.89 | 53.34,8.89 52.7,8.89 48.26,13.34 | 63.82,7.29 64.8,7.29 | R22.2 64.8,8.88 64.8,7.29 | 66.6,11.86 66.6,7.29 64.8,7.29 | C10.1 85.41,5.08 | 26.3,19.26 C3.2 C11.1
  Top 0.203: 32.4,27.18 29.18,27.18 27.68,25.68 U1.48 25.89,22.16 26.09,21.96 R5.1 26.09,19.47 C3.2 27.31,19.36 29.84,16.83 29.84,15.56 32.07,13.34 48.26,13.34 | 32.4,27.18 U1.16 | U1.22 32.81,30.17 32.33,29.69 32.33,27.24 32.4,27.18 | IC1.36 68.05,11.86 | IC1.48 66.6,11.86 68.05,11.86 | 68.05,11.86 72.05,11.86 | 72.05,11.86 IC1.9 | 73.55,11.86 72.05,11.86 | 73.55,11.86 74.3,11.11 74.93,11.11 | 58.52,9.54 R23.2 | 58.52,9.54 59.81,9.54 U3.VCC | 63.82,7.29 63.82,7.3 57.15,7.3 57.15,9.53 58.52,9.53 58.52,9.54 | 73.66,15.88 73.66,11.96 73.55,11.86
+5V
  Top 0.2: 40.74,28.8 40.65,28.87 38.8,28.87 | R11.2 71.42,21.59 67.87,21.59 | 67.87,21.59 62.83,21.59 U$1.94 | R10.2 67.87,22.58 67.87,21.59 | 85.41,10.79 85.41,8.04 IC2.3 87.68,7.38 C8.1 | U$1.115 65.65,33.02 66.36,33.02 66.38,32.99 | 66.38,32.99 77.47,21.91 85.72,21.91 85.72,18.41 | 66.38,32.99 66.38,34.59 U$2.VCC U$2.EN 67.45,37.61 68.9,39.05 R28.2 | U$1.71 50.47,14.29 50.16,14.29 49.53,14.92 C9.1
  Top 0.203: 60.74,33.77 56.9,37.61 | 63.6,30.91 60.74,33.77 | 63.6,30.91 64.4,28.84 63.89,27.76 60.77,23.69 | 56.9,37.61 53.22,41.28 51.72,39.78 | 45.02,33.08 44.62,32.68 | 51.36,39.42 45.02,33.08 | 51.72,39.78 51.36,39.42 | 44.62,32.68 40.65,28.87 43.59,25.78 43.58,25.78 U$1.45 | 49.27,20.09 52.8,16.56 | 46.4,22.96 46.07,23.3 46.05,23.3 U$1.52 | 46.4,22.96 49.27,20.09 | 53.22,16.14 52.8,16.56 | 54.05,16.96 60.41,23.33 | 54.05,16.96 53.22,16.14 | 60.77,23.69 60.41,23.33 | U$1.93 60.41,23.29 60.41,23.33 | U$1.94 60.77,23.64 60.77,23.69 | U$1.75 54.05,16.94 54.05,16.96 | U$1.71 52.75,16.56 52.8,16.56 | U$1.61 49.2,20.09 49.27,20.09 | U$1.53 46.4,22.96 | U$1.25 44.62,32.72 44.62,32.68 | U$1.24 44.98,33.08 45.02,33.08 | 51.36,39.42 51.35,39.42 U$1.6 49.11,41.66 | U$1.5 51.72,39.78 | U$1.134 56.9,37.71 56.9,37.61 | U$1.123 60.76,33.77 60.74,33.77 | U$1.115 63.6,30.97 63.6,30.91 | R13.2 53.22,15.22 53.22,16.14 | 49.04,41.73 49.11,41.66 | 48.65,42.09 R15.2 | 48.65,42.09 R12.2 | 49.11,41.66 48.68,42.09 48.65,42.09 | R14.2 38.8,28.87
  Top 0.254: 85.72,18.41 85.72,13.01 85.41,13.01 | J1.VBUS 85.25,13.01 85.41,13.01 | 85.41,10.79 85.41,13.01
AT24_SCL
  Top 0.203: IC1.42 62.41,14.86 U3.SCL 62.41,8.24 R23.1
AT24_SDA
  Top 0.2: U3.SDA 65.09,10.92 R22.1
  Top 0.203: IC1.43 63.71,14.36 U3.SDA
CFG_!CONFIG
  Top 0.2: 56.45,13.91 R13.1 56.76,14.29 58.42,14.29 65.09,20.95 69.85,20.95 70.55,20.25 IC1.31
  Top 0.203: R13.1 54.92,15.37 U$1.74
CFG_!STATUS
  Top 0.203: U$1.35 38.83,31.43 38.12,31.43 | 38.12,31.43 38.1,31.43 | R14.1 37.98,31.43 38.12,31.43
CFG_DATA
  Top 0.2: 71.76,22.54 U$1.108 | 71.76,22.54 72.05,22.24 IC1.28 | R10.1 70.23,22.54 71.76,22.54
CFG_DCLK
  Top 0.2: U$1.107 65.72,27.89 66.04,28.57 67.94,28.57 72.72,23.8 R11.1 72.72,19.99 73.05,19.66 IC1.26
CFG_DONE
  Top 0.2: R27.2 57.48,42.21 55.56,44.13 50.68,44.13 R15.1
  Top 0.203: U$1.2 50.09,43.52 R15.1
CFG_IDONE
  Top 0.203: U$1.14 46.04,39.09 46.04,39.49 R12.1
CLK
  Top 0.203: U$1.125 63.06,37.47 U$2.OUT
CLK_DAC
  Top 0.203: U1.17 35.7,27.66 35.82,27.79 35.82,28.17 | U1.20 35.7,29.18 35.82,29.06 35.82,28.71 | 35.82,28.42 35.82,28.17 | 35.82,28.42 35.82,28.71 | U1.18 35.82,28.17 | U1.19 35.79,28.68 35.82,28.71 | U$1.37 38.82,26.67 37.15,26.67 36.51,27.3 36.51,27.94 36.03,28.42 35.82,28.42
FSADJ1
  Top 0.2: U1.44 20.95,27.66 20.95,27.62 20.8,27.62 R6.2 19.48,27.73 R8.2
FSADJ2
  Top 0.203: U1.41 27.06,29.18 27.57,29.69 27.57,30.96 26.62,31.91 26.62,35.72 R7.2 25.66,35.78 R9.1
GND  (via drill 0.35)  (2 unrouted)
  Top 0.2: 56.83,15.56 U$1.77 | 56.83,15.56 | 56.83,15.56 56.83,15.55 56.52,15.24 56.46,15.24 U$1.76 54.93,16.77 54.93,16.83 | 55.56,40.01 55.68,40.01 U$1.139 57.15,41.48 57.15,41.59 | 61.59,37.47 61.59,37.44 U$1.127 59.71,35.56 59.69,35.56 | 60.96,38.1 60.85,38.1 U$1.129 59.05,36.3 59.05,36.2 | 66.99,25.72 66.99,25.9 U$1.106 65.41,27.49 65.41,27.62 | 66.36,25.08 66.36,25.14 U$1.104 64.82,26.67 64.45,26.67 64.45,26.32 U$1.103 66.33,24.45 66.36,24.45 | 57.78,19.68 57.78,19.55 U$1.84 59.24,18.1 59.69,18.1 59.69,18.37 U$1.85 58.1,19.96 58.1,20 | U$1.66 48.9,16.27 48.9,16.19 | 45.64,19.37 U$1.57 | 45.64,19.37 45.09,19.37 | U$1.58 46.36,19.37 45.64,19.37 | 43.18,21.91 43.22,21.91 U$1.50 44.81,23.5 45.09,23.5 | U1.15 35.56,26.67 | U1.21 35.7,29.67 arc90 35.88,29.84 | U$1.40 41.27,27 41.27,27.3 40.32,28.42 38.1,28.42 v37.78,27.94 | 27.3,28.57 arc90 27.2,28.68 U1.42 24.35,28.68 arc-90 24.13,28.89 | IC1.35 68.55,19.66 arc-90 68.58,19.68 | IC1.23 76.2,16.86 76.2,13.02 77.79,13.02 77.79,12.06 | 78.11,12.06 78.74,11.75 | IC1.8 71.55,11.31 71.44,11.43 | 67.63,12.38 67.6,12.36 IC1.47 65.75,12.36 65.72,12.38 | 65.09,13.65 65.29,13.86 IC1.44 67.63,13.86 67.63,13.97 | IC1.38 67.31,16.86 67.31,16.83 | 65.41,29.05 65.72,28.89 65.41,28.89 65.41,29.05 | 66.99,29.05 65.41,29.05 | U$1.15 46,38.42 45.72,38.42 45.72,37.98 U$1.16 | JP3.1 9.05,23.34 9.05,17.46 10.64,15.88 16.35,15.88 13.02,12.54 13.02,10.48 11.59,9.05 8.26,9.05 9.68,7.62 9.68,4.6 11.43,2.86 15.08,2.86 17.3,5.08 23.81,5.08 25.4,6.67 25.4,7.3 26.04,7.94 30.16,7.94 32.7,5.4 35.72,5.4 34.13,3.81 34.13,2.7 26.04,2.7 30.32,6.99 32.23,6.99 34.29,9.05 36.83,9.05 37.31,8.57 38.26,8.57 38.89,7.94 42.7,7.94 43.02,8.26 43.34,8.26 44.13,9.05 46.2,9.05 46.51,9.37 47.31,9.37 47.78,9.84 47.78,10 49.21,8.57 JP2.1
  other vias: 59.69,17.46 60.96,12.7 66.04,19.05 53.02,12.7 44.45,19.05 42.23,20 36.83,25.72 33.97,33.97 25.4,33.97
  pour Top (isolate 0.25): 91.12,45.4 91.12,0.64 5.4,0.95 5.71,45.4
  pour Bottom: 5.71,45.09 5.4,0.95 91.12,0.95 91.12,45.4 5.71,45.4
IO7
  Top 0.2: U$1.17 44.77,38.25 R29.2
IOUTA1
  Top 0.2: U1.46 23.81,26.67 23.81,25.72 16.83,25.72 16.83,24.13 JP1.1 14.29,24.29 R4.1
IOUTA2
  Top 0.2: U1.39 24.77,30.17 24.77,31.75 JP1.4 12.38,31.75 12.38,31.6 R3.1
IOUTB1
  Top 0.2: U1.45 23.18,27.18 23.18,26.35 16.19,26.35 16.19,26.67 JP1.2 14.29,26.52 R2.1
IOUTB2
  Top 0.2: U1.40 24.13,29.67 24.13,31.11 16.19,31.11 16.19,29.21 JP1.3 12.28,29.21 R1.1
N$1
  Top 0.2: C4.2 R8.1
N$2
  Top 0.203: C5.2 R9.2
N$3
  Top 0.2: 22.81,21.05 C2.1 C12.2 | 25.08,26.16 24.71,26.16 24.71,25.88
  Top 0.203: U1.47 25.08,26.16 24.99,26.16 | 24.71,25.88 24.71,23.66 24.71,22.49 24.29,22.06 R5.2 23.03,21.28 C2.1
N$5
  Top 0.2: U1.43 22.34,28.17 C1.1
N$6
  Top 0.2: R18.2 81.32,13.96 J1.D-
N$7
  Top 0.2: R27.1 R25.2 60.63,43.51 60.64,43.5 60.96,43.81 U$5.1
N$8
  Top 0.2: 81.32,14.59 R17.2 | 81.32,14.59 J1.D+ | R19.2 81.32,14.62 81.32,14.59
N$9
  Top 0.2: U$4.3 80.33,12.69 R19.1
N$10
  Top 0.203: IC1.5 70.05,4.88 U$3.3 66.36,4.88 C6.2
N$11
  Top 0.203: IC1.6 70.55,7.18 U$3.1 74.3,7.18 C7.2
N$12
  Top 0.2: U$4.1 78.11,8.57 R21.2
N$13
  Top 0.2: U$7.A 44.77,43.76 R29.1
N$14
  Top 0.2: U$5.3 U$6.C
N$15
  Top 0.2: U$6.A 68.9,42.86 R28.1
N$16
  Top 0.2: 46.67,20.32 47.31,21.11 47.47,21.11 47.47,20.95
P1_DB0
  Top 0.203: RN5.8 37.45,24.61 U$1.38
P1_DB0=
  Top 0.203: U1.14 35.44,26.16 35.7,25.58 RN5.1
P1_DB1
  Top 0.203: RN5.7 37.62,24.06 U$1.39
P1_DB1=
  Top 0.203: RN5.2 34.99,24.06 34.32,24.73 U1.13
P1_DB2
  Top 0.203: RN5.6 38.52,23.56 U$1.41
P1_DB2=
  Top 0.203: RN5.3 34.54,23.56 33.97,24.13 32.93,24.13 U1.12
P1_DB3
  Top 0.203: RN5.5 38.69,23.01 U$1.42
P1_DB3=
  Top 0.203: RN5.4 32.55,23.01 32.37,23.19 U1.11
P1_DB4
  Top 0.203: RN6.8 37.51,21.12 U$1.43
P1_DB4=
  Top 0.203: RN6.1 32.85,21.12 31.86,22.11 U1.10
P1_DB5
  Top 0.203: 41.95,24.92 U$1.44 37.65,20.57 RN6.7
P1_DB5=
  Top 0.203: U1.9 31.35,21.99 32.77,20.57 RN6.2
P1_DB6
  Top 0.203: RN6.6 38.58,20.07 U$1.46
P1_DB6=
  Top 0.203: U1.8 30.87,21.84 32.63,20.07 RN6.3
P1_DB7
  Top 0.203: U$1.47 38.72,19.52 RN6.5
P1_DB7=
  Top 0.203: U1.7 30.36,21.71 32.55,19.52 RN6.4
P1_DB8
  Top 0.203: RN7.8 38.49,18.58 U$1.48
P1_DB8=
  Top 0.203: U1.6 29.85,21.26 32.54,18.58 RN7.1
P1_DB9
  Top 0.203: RN7.7 38.66,18.03 U$1.49
P1_DB9=
  Top 0.203: U1.5 29.35,21.14 32.45,18.03 RN7.2
P1_DB10
  Top 0.203: 41.5,17.69 41.34,17.53 RN7.6 | 41.5,17.69 43.81,20 | U$1.51 43.81,21.78 43.81,20 | 43.81,20 41.5,17.69
P1_DB10=
  Top 0.203: U1.4 28.86,20.98 32.02,17.82 | 32.02,17.82 32.07,17.78 | RN7.3 32.32,17.53 32.02,17.82
P1_DB11
  Top 0.203: RN7.5 44.69,16.98 U$1.59
P1_DB11=
  Top 0.203: U1.3 28.36,20.86 32.23,16.98 RN7.4
P1_DB12
  Top 0.203: RN8.8 44.43,16.04 U$1.60
P1_DB12=
  Top 0.203: U1.2 27.85,20.73 32.54,16.04 RN8.1
P1_DB13
  Top 0.203: RN8.7 45.32,15.49 U$1.62
P1_DB13=
  Top 0.203: U1.1 27.36,20.58 32.45,15.49 RN8.2
P2_DB0
  Top 0.203: U$1.18 40.22,42.08 RN1.8
P2_DB0=
  Top 0.203: U1.36 27.36,40.06 29.07,41.77 | 29.07,41.77 29.21,41.91 | RN1.1 29.38,42.08 29.07,41.77
P2_DB1
  Top 0.203: U$1.19 40.05,41.52 RN1.7
P2_DB1=
  Top 0.203: U1.35 27.85,39.91 29.46,41.52 RN1.2
P2_DB2
  Top 0.203: U$1.20 39.84,41.02 RN1.6
P2_DB2=
  Top 0.203: U1.34 28.36,39.78 29.14,40.56 | 29.14,40.56 29.21,40.64 | RN1.3 29.59,41.02 29.14,40.56
P2_DB3
  Top 0.203: U$1.21 39.7,40.48 RN1.5
P2_DB3=
  Top 0.203: U1.33 28.86,39.66 29.01,39.8 | 29.01,39.8 29.21,40.01 | RN1.4 29.68,40.48 29.01,39.8
P2_DB4
  Top 0.203: U$1.22 39.92,39.53 RN2.8
P2_DB4=
  Top 0.203: U1.32 29.35,38.55 30.33,39.53 RN2.1
P2_DB5
  Top 0.203: U$1.23 39.76,38.98 RN2.7
P2_DB5=
  Top 0.203: U1.31 29.85,38.43 30.41,38.98 RN2.2
P2_DB6
  Top 0.203: U$1.26 38.14,38.48 RN2.6
P2_DB6=
  Top 0.203: U1.30 30.36,38.3 30.55,38.48 RN2.3
P2_DB7
  Top 0.203: U$1.27 38,37.94 RN2.5
P2_DB7=
  Top 0.203: U1.29 30.87,37.22 31.37,37.72 | 31.37,37.72 31.43,37.78 | RN2.4 31.59,37.94 31.37,37.72
P2_DB8
  Top 0.203: U$1.28 38.54,36.68 RN3.8
P2_DB8=
  Top 0.203: U1.28 31.35,36.12 31.91,36.68 RN3.1
P2_DB9
  Top 0.203: U$1.29 38.37,36.13 RN3.7
P2_DB9=
  Top 0.203: U1.27 31.86,35.67 32.02,35.83 | 32.02,35.83 32.07,35.88 | RN3.2 32.32,36.13 32.02,35.83
P2_DB10
  Top 0.203: U$1.30 38.19,35.63 RN3.6
P2_DB10=
  Top 0.203: U1.26 32.37,35.23 32.77,35.63 RN3.3
P2_DB11
  Top 0.203: U$1.31 38.02,35.08 RN3.5
P2_DB11=
  Top 0.203: U1.25 32.85,34.76 33.17,35.08 RN3.4
P2_DB12
  Top 0.203: RN4.6 39.3,33.09 U$1.32
P2_DB12=
  Top 0.203: RN4.3 34.32,33.09 U1.24
P2_DB13
  Top 0.203: RN4.5 39.16,32.54 U$1.33
P2_DB13=
  Top 0.203: U1.23 36.01,30.68 RN4.4
SWD_CLK
  Top 0.2: 56.2,10.48 55.24,9.53 55.24,6.67 54.29,5.71 JP2.3 | 61.59,15.24 59.05,12.7 58.42,12.7
  Top 0.203: 58.42,12.7 56.2,10.48 | IC1.37 63.71,17.36 61.59,15.24
SWD_DIO
  Top 0.2: 68.9,20.32 69.05,20.32 69.05,19.85 | 55.56,11.11 54.61,10.16 54.61,7.94 51.75,5.08 JP2.2 | 60.64,15.56 58.74,13.65 58.1,13.65 | 63.5,18.41 65.41,20.32 67.74,20.32
  Top 0.203: 69.05,19.85 IC1.34 | 65.41,20.32 67.74,20.32 68.9,20.32 | 58.1,13.65 55.56,11.11 | 60.64,15.56 63.5,18.41
SWDIO_!RST
  Top 0.2: IC1.7 71.05,8.89 R16.1 | R16.1 74.61,8.89 | R16.1 75.25,8.89 75.25,7.94 75.88,7.3 75.88,3.17 75.25,2.54 58.74,2.54 57.78,3.49 JP2.4
USB_DM
  Top 0.2: 74.61,18.73 73.66,17.78 70.05,17.78 70.05,17.89 | 75.56,18.73 78.74,18.73 R18.1
  Top 0.203: 70.05,17.89 IC1.32 | 74.61,18.73 75.56,18.73
USB_DP
  Top 0.2: 74.61,18.1 74.23,17.78 73.28,16.83 69.55,16.83 69.55,17.44 | 75.88,18.1 77.15,18.1 R17.1
  Top 0.203: 69.55,17.44 IC1.33 | 74.61,18.1 75.88,18.1
USB_EN
  Top 0.2: R21.1 80.01,8.57 U$4.2 80.01,11.13 79.99,11.11 78.74,11.11 78.41,11.45 R20.2 76.83,11.86 IC1.13
(copper drawn outside any net)
  shapes: Top circle x1